# Altium schematic sheet Power.SchDoc
size A4; Revision: B.1(PCB.SCH)
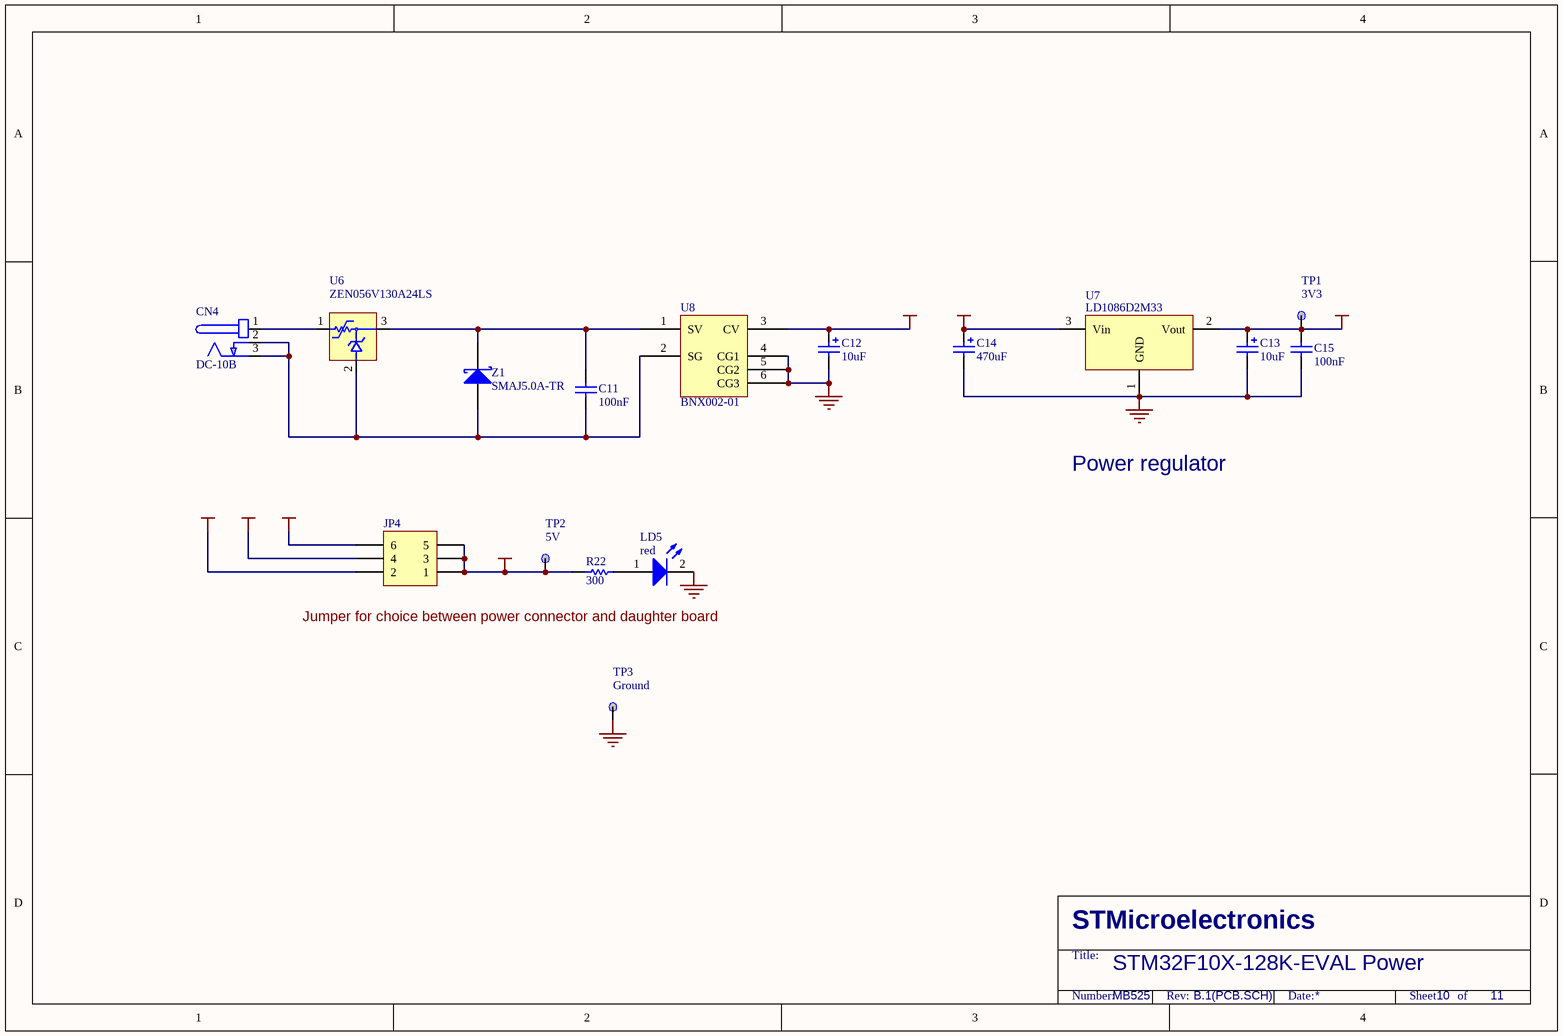
[diagram p0: Power.SchDoc]

## Parts
C11  100nF  [0603P]
C12  10uF  [C160M]
C13  10uF  [TAN-B]
C14  470uF  [C310M]
C15  100nF  [0603P]
CN4  DC-10B  [DC10B]
JP4  (no value)  [2*3P]
LD5  red  [D0603]
R22  300  [0603]
TP1  3V3  [TP]
TP2  5V  [TP]
TP3  Ground  [TP]
U6  ZEN056V130A24LS  [polyzen]
U7  LD1086D2M33  [D2PAK/A]
U8  BNX002-01  [BNX001]
Z1  SMAJ5.0A-TR  [1R1C]

## Nets
+3V3: C13.1 C15.1 TP1.1 U7.2(Vout)
+5V: C14.1 JP4.1 JP4.3 JP4.5 R22.2 TP2.1 U7.3(Vin)
D5V: JP4.4
E5V: C12.1 JP4.6 U8.3(CV)
GND: C12.2 C13.2 C14.2 C15.2 LD5.2(K) TP3.1 U7.1(GND) U8.4(CG1) U8.5(CG2) U8.6(CG3)
U5V: JP4.2
NetC11_1: C11.1 U6.3 U8.1(SV) Z1.2(K)
NetC11_2: C11.2 CN4.2(GND) CN4.3(GND) U6.2 U8.2(SG) Z1.1(A)
NetCN4_1: CN4.1(+) U6.1
NetLD5_1: LD5.1(A) R22.1

## Notes on the sheet
- Power regulator
- Jumper for choice between power connector and daughter board
- STM32F10X-128K-EVAL Power
- MB525
- 10
- 11
- STMicroelectronics
- Title:
- Number:
- Rev:
- Date:
- Sheet       of

## Library data of the parts
C11 = CAP: Capacitor; Value: 100pF; Published: 8-Jun-2000; Revision: July-2002: Re-released for DXP Platform.; Publisher: Altium Limited
C12 = Cap Pol1: Polarized Capacitor (Radial); Value: 47uF; Published: 8-Jun-2000; Revision: July-2002: Re-released for DXP Platform.; Publisher: Altium Limited
C13 = Cap Pol1: Polarized Capacitor (Radial); Published: 8-Jun-2000; Revision: July-2002: Re-released for DXP Platform.; Publisher: Altium Limited; Value: 10uF
C14 = Cap Pol1: Polarized Capacitor (Radial); Value: 10uF; Published: 8-Jun-2000; Revision: July-2002: Re-released for DXP Platform.; Publisher: Altium Limited
C15 = Cap: Capacitor; Value: 10nF; Published: 8-Jun-2000; Revision: July-2002: Re-released for DXP Platform.; Publisher: Altium Limited
CN4 = PJ202A
JP4 = Header 3X2: Header, 3-Pin, Dual row; Revision: 17-Jul-2002: Re-released for DXP Platform.; Publisher: Altium Limited
LD5 = LED2: Typical RED, GREEN, YELLOW, AMBER GaAs LED; Published: 8-Jun-2000; Revision: July-2002: Re-released for DXP Platform.; Publisher: Altium Limited
R22 = res1: Resistor; Value: 1K; Published: 8-Jun-2000; Revision: July-2002: Re-released for DXP Platform.; Publisher: Altium Limited
TP1-TP3 = TP
U7 = VOLTREG1
U8 = BNX002
Z1 = D Schottky: Schottky Diode; Code - JEDEC: DO-214-AA; Published: 8-Jun-2000; Revision: July-2002: Re-released for DXP Platform.; Publisher: Altium Limited